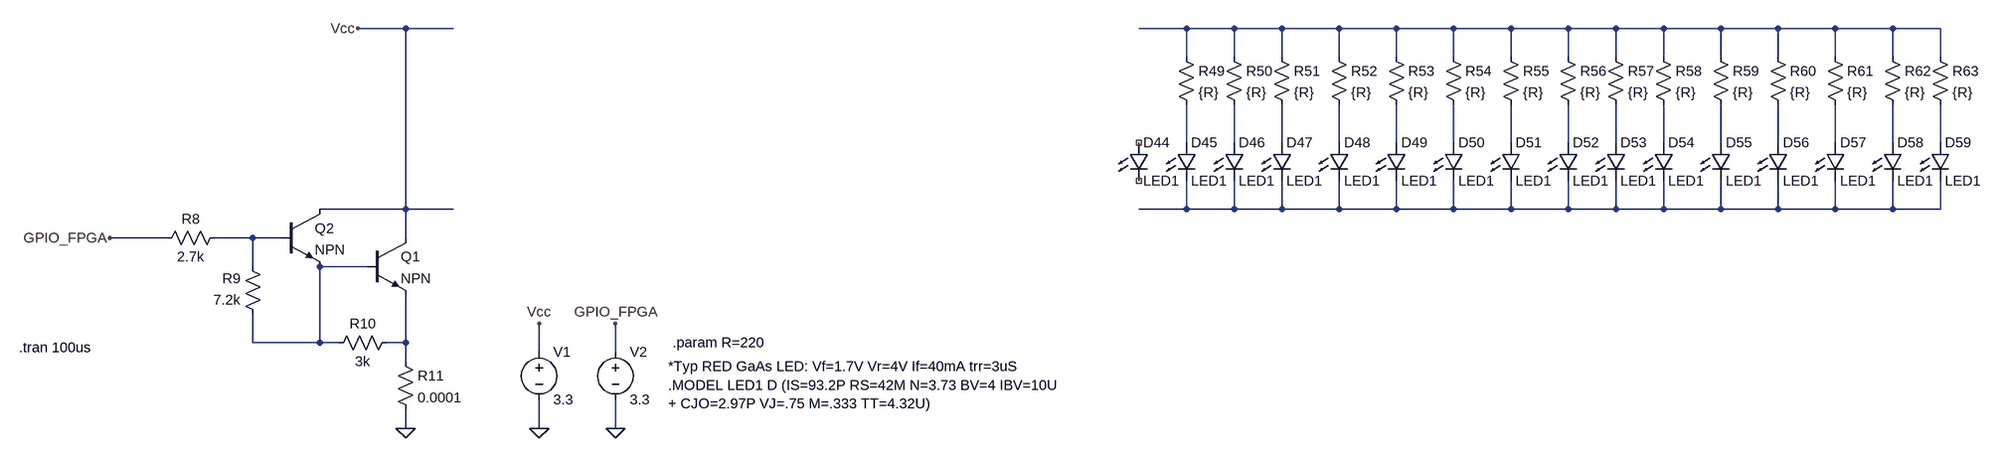
[diagram p0: schematic ULN2068B_test.asc]
ULN2068B_test.asc, the LTspice schematic file:
Version 4
SHEET 1 5320 680
WIRE 208 -256 128 -256
WIRE 288 -256 208 -256
WIRE 3984 -256 3904 -256
WIRE 4064 -256 3984 -256
WIRE 4144 -256 4064 -256
WIRE 4240 -256 4144 -256
WIRE 4336 -256 4240 -256
WIRE 4432 -256 4336 -256
WIRE 4528 -256 4432 -256
WIRE 4624 -256 4528 -256
WIRE 4704 -256 4624 -256
WIRE 4784 -256 4704 -256
WIRE 4880 -256 4784 -256
WIRE 4976 -256 4880 -256
WIRE 5072 -256 4976 -256
WIRE 5168 -256 5072 -256
WIRE 5248 -256 5168 -256
WIRE 3984 -208 3984 -256
WIRE 4064 -208 4064 -256
WIRE 4144 -208 4144 -256
WIRE 4240 -208 4240 -256
WIRE 4336 -208 4336 -256
WIRE 4432 -208 4432 -256
WIRE 4528 -208 4528 -256
WIRE 4624 -208 4624 -256
WIRE 4704 -208 4704 -256
WIRE 4784 -208 4784 -256
WIRE 4880 -208 4880 -256
WIRE 4976 -208 4976 -256
WIRE 5072 -208 5072 -256
WIRE 5168 -208 5168 -256
WIRE 5248 -208 5248 -256
WIRE 3984 -64 3984 -128
WIRE 4064 -64 4064 -128
WIRE 4144 -64 4144 -128
WIRE 4240 -64 4240 -128
WIRE 4336 -64 4336 -128
WIRE 4432 -64 4432 -128
WIRE 4528 -64 4528 -128
WIRE 4624 -64 4624 -128
WIRE 4704 -64 4704 -128
WIRE 4784 -64 4784 -128
WIRE 4880 -64 4880 -128
WIRE 4976 -64 4976 -128
WIRE 5072 -64 5072 -128
WIRE 5168 -64 5168 -128
WIRE 5248 -64 5248 -128
WIRE 208 48 208 -256
WIRE 208 48 64 48
WIRE 288 48 208 48
WIRE 3984 48 3984 0
WIRE 3984 48 3904 48
WIRE 4064 48 4064 0
WIRE 4064 48 3984 48
WIRE 4144 48 4144 0
WIRE 4144 48 4064 48
WIRE 4240 48 4240 0
WIRE 4240 48 4144 48
WIRE 4336 48 4336 0
WIRE 4336 48 4240 48
WIRE 4432 48 4432 0
WIRE 4432 48 4336 48
WIRE 4528 48 4528 0
WIRE 4528 48 4432 48
WIRE 4624 48 4624 0
WIRE 4624 48 4528 48
WIRE 4704 48 4704 0
WIRE 4704 48 4624 48
WIRE 4784 48 4784 0
WIRE 4784 48 4704 48
WIRE 4880 48 4880 0
WIRE 4880 48 4784 48
WIRE 4976 48 4976 0
WIRE 4976 48 4880 48
WIRE 5072 48 5072 0
WIRE 5072 48 4976 48
WIRE 5168 48 5168 0
WIRE 5168 48 5072 48
WIRE 5248 48 5248 0
WIRE 5248 48 5168 48
WIRE -192 96 -288 96
WIRE -48 96 -112 96
WIRE 0 96 -48 96
WIRE 208 96 208 48
WIRE -48 144 -48 96
WIRE 144 144 64 144
WIRE -48 272 -48 224
WIRE 64 272 64 144
WIRE 64 272 -48 272
WIRE 96 272 64 272
WIRE 208 272 208 192
WIRE 208 272 176 272
WIRE 432 288 432 240
WIRE 560 288 560 240
WIRE 208 304 208 272
WIRE 208 416 208 384
WIRE 432 416 432 368
WIRE 560 416 560 368
FLAG 208 416 0
FLAG -288 96 GPIO_FPGA
FLAG 128 -256 Vcc
FLAG 432 416 0
FLAG 432 240 Vcc
FLAG 560 416 0
FLAG 560 240 GPIO_FPGA
SYMBOL npn 144 96 R0
SYMATTR InstName Q1
SYMBOL res -96 80 R90
WINDOW 0 0 56 VBottom 2
WINDOW 3 32 56 VTop 2
SYMATTR InstName R8
SYMATTR Value 2.7k
SYMBOL res -32 240 R180
WINDOW 0 36 76 Left 2
WINDOW 3 36 40 Left 2
SYMATTR InstName R9
SYMATTR Value 7.2k
SYMBOL voltage 432 272 R0
WINDOW 123 0 0 Left 0
WINDOW 39 0 0 Left 0
SYMATTR InstName V1
SYMATTR Value 3.3
SYMBOL voltage 560 272 R0
WINDOW 123 0 0 Left 0
WINDOW 39 0 0 Left 0
SYMATTR InstName V2
SYMATTR Value 3.3
SYMBOL npn 0 48 R0
SYMATTR InstName Q2
SYMBOL res 192 256 R90
WINDOW 0 0 56 VBottom 2
WINDOW 3 32 56 VTop 2
SYMATTR InstName R10
SYMATTR Value 3k
SYMBOL res 192 288 R0
SYMATTR InstName R11
SYMATTR Value 0.0001
SYMBOL LED 3888 -64 R0
SYMATTR InstName D44
SYMATTR Value LED1
SYMBOL LED 3968 -64 R0
SYMATTR InstName D45
SYMATTR Value LED1
SYMBOL LED 4048 -64 R0
SYMATTR InstName D46
SYMATTR Value LED1
SYMBOL res 3968 -224 R0
SYMATTR InstName R49
SYMATTR Value {R}
SYMBOL res 4048 -224 R0
SYMATTR InstName R50
SYMATTR Value {R}
SYMBOL LED 4128 -64 R0
SYMATTR InstName D47
SYMATTR Value LED1
SYMBOL res 4128 -224 R0
SYMATTR InstName R51
SYMATTR Value {R}
SYMBOL LED 4224 -64 R0
SYMATTR InstName D48
SYMATTR Value LED1
SYMBOL res 4224 -224 R0
SYMATTR InstName R52
SYMATTR Value {R}
SYMBOL LED 4320 -64 R0
SYMATTR InstName D49
SYMATTR Value LED1
SYMBOL res 4320 -224 R0
SYMATTR InstName R53
SYMATTR Value {R}
SYMBOL LED 4416 -64 R0
SYMATTR InstName D50
SYMATTR Value LED1
SYMBOL res 4416 -224 R0
SYMATTR InstName R54
SYMATTR Value {R}
SYMBOL LED 4512 -64 R0
SYMATTR InstName D51
SYMATTR Value LED1
SYMBOL res 4512 -224 R0
SYMATTR InstName R55
SYMATTR Value {R}
SYMBOL LED 4608 -64 R0
SYMATTR InstName D52
SYMATTR Value LED1
SYMBOL res 4608 -224 R0
SYMATTR InstName R56
SYMATTR Value {R}
SYMBOL LED 4688 -64 R0
SYMATTR InstName D53
SYMATTR Value LED1
SYMBOL res 4688 -224 R0
SYMATTR InstName R57
SYMATTR Value {R}
SYMBOL LED 4768 -64 R0
SYMATTR InstName D54
SYMATTR Value LED1
SYMBOL res 4768 -224 R0
SYMATTR InstName R58
SYMATTR Value {R}
SYMBOL LED 4864 -64 R0
SYMATTR InstName D55
SYMATTR Value LED1
SYMBOL res 4864 -224 R0
SYMATTR InstName R59
SYMATTR Value {R}
SYMBOL LED 4960 -64 R0
SYMATTR InstName D56
SYMATTR Value LED1
SYMBOL res 4960 -224 R0
SYMATTR InstName R60
SYMATTR Value {R}
SYMBOL LED 5056 -64 R0
SYMATTR InstName D57
SYMATTR Value LED1
SYMBOL res 5056 -224 R0
SYMATTR InstName R61
SYMATTR Value {R}
SYMBOL LED 5152 -64 R0
SYMATTR InstName D58
SYMATTR Value LED1
SYMBOL res 5152 -224 R0
SYMATTR InstName R62
SYMATTR Value {R}
SYMBOL LED 5232 -64 R0
SYMATTR InstName D59
SYMATTR Value LED1
SYMBOL res 5232 -224 R0
SYMATTR InstName R63
SYMATTR Value {R}
TEXT 656 272 Left 2 !.param R=220
TEXT -440 280 Left 2 !.tran 100us
TEXT 648 312 Left 2 !*Typ RED GaAs LED: Vf=1.7V Vr=4V If=40mA trr=3uS\n.MODEL LED1 D (IS=93.2P RS=42M N=3.73 BV=4 IBV=10U\n+ CJO=2.97P VJ=.75 M=.333 TT=4.32U)

The netlist it stands for:
* ULN2068B_test.asc
Q1 Vcc N019 N020 0 NPN
R8 N018 GPIO_FPGA 2.7k
R9 N019 N018 7.2k
V1 Vcc 0 3.3
V2 GPIO_FPGA 0 3.3
Q2 Vcc N018 N019 0 NPN
R10 N020 N019 3k
R11 N020 0 0.0001
D44 NC_01 NC_02 LED1
D45 N002 N017 LED1
D46 N003 N017 LED1
R49 N001 N002 {R}
R50 N001 N003 {R}
D47 N004 N017 LED1
R51 N001 N004 {R}
D48 N005 N017 LED1
R52 N001 N005 {R}
D49 N006 N017 LED1
R53 N001 N006 {R}
D50 N007 N017 LED1
R54 N001 N007 {R}
D51 N008 N017 LED1
R55 N001 N008 {R}
D52 N009 N017 LED1
R56 N001 N009 {R}
D53 N010 N017 LED1
R57 N001 N010 {R}
D54 N011 N017 LED1
R58 N001 N011 {R}
D55 N012 N017 LED1
R59 N001 N012 {R}
D56 N013 N017 LED1
R60 N001 N013 {R}
D57 N014 N017 LED1
R61 N001 N014 {R}
D58 N015 N017 LED1
R62 N001 N015 {R}
D59 N016 N017 LED1
R63 N001 N016 {R}
.model D D
.lib standard.dio
.model NPN NPN
.model PNP PNP
.lib standard.bjt
.param R=220
.tran 100us
*Typ RED GaAs LED: Vf=1.7V Vr=4V If=40mA trr=3uS
.MODEL LED1 D (IS=93.2P RS=42M N=3.73 BV=4 IBV=10U
+ CJO=2.97P VJ=.75 M=.333 TT=4.32U)
.backanno
.end